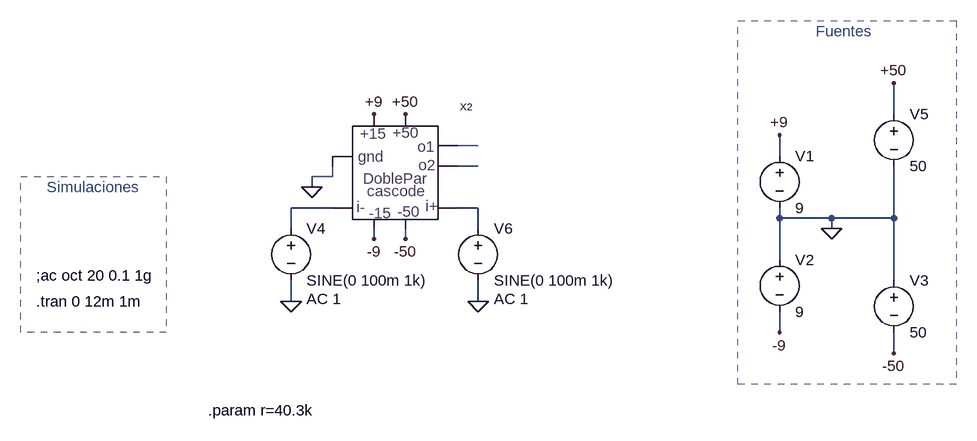
[diagram p0: schematic CMRR-doble-par.asc]
CMRR-doble-par.asc, the LTspice schematic file:
Version 4
SHEET 1 980 680
WIRE 880 32 880 -16
WIRE 240 80 208 80
WIRE 704 96 704 64
WIRE 240 112 208 112
WIRE 16 128 16 112
WIRE 16 128 -16 128
WIRE -16 144 -16 128
WIRE 16 176 -48 176
WIRE 240 176 208 176
WIRE 704 192 704 176
WIRE 784 192 704 192
WIRE 880 192 880 112
WIRE 880 192 784 192
WIRE -48 208 -48 176
WIRE 240 208 240 176
WIRE 784 208 784 192
WIRE 80 224 80 208
WIRE 128 224 128 208
WIRE 704 256 704 192
WIRE 880 288 880 192
WIRE -48 320 -48 288
WIRE 240 320 240 288
WIRE 704 368 704 336
WIRE 880 400 880 368
FLAG 784 208 0
FLAG 704 64 +9
FLAG 704 368 -9
FLAG 880 400 -50
FLAG 80 32 +9
FLAG 80 224 -9
FLAG 128 224 -50
FLAG 240 320 0
FLAG -48 320 0
FLAG 880 -16 +50
FLAG 128 32 +50
FLAG -16 144 0
SYMBOL rui\\shortcuts\\voltage 704 80 R0
WINDOW 123 0 0 Left 2
WINDOW 39 0 0 Left 2
SYMATTR InstName V1
SYMATTR Value 9
SYMBOL rui\\shortcuts\\voltage 704 240 R0
WINDOW 123 0 0 Left 2
WINDOW 39 0 0 Left 2
SYMATTR InstName V2
SYMATTR Value 9
SYMBOL rui\\shortcuts\\voltage 880 272 R0
WINDOW 123 0 0 Left 2
WINDOW 39 0 0 Left 2
SYMATTR InstName V3
SYMATTR Value 50
SYMBOL rui\\shortcuts\\voltage -48 192 R0
WINDOW 123 24 124 Left 2
WINDOW 39 0 0 Left 2
SYMATTR Value2 AC 1
SYMATTR InstName V4
SYMATTR Value SINE(0 100m 1k)
SYMBOL rui\\shortcuts\\voltage 880 16 R0
WINDOW 123 0 0 Left 2
WINDOW 39 0 0 Left 2
SYMATTR InstName V5
SYMATTR Value 50
SYMBOL ss-doble-par 112 112 R0
SYMATTR InstName X2
SYMATTR SpiceLine rcs=2k4
SYMBOL rui\\shortcuts\\voltage 240 192 R0
WINDOW 123 24 124 Left 2
WINDOW 39 0 0 Left 2
SYMATTR Value2 AC 1
SYMATTR InstName V6
SYMATTR Value SINE(0 100m 1k)
TEXT -440 320 Left 2 !.tran 0 12m 1m
TEXT -440 280 Left 2 !;ac oct 20 0.1 1g
TEXT -176 488 Left 2 !.param r=40.3k
TEXT -424 144 Left 2 ;Simulaciones
TEXT 760 -96 Left 2 ;Fuentes
RECTANGLE Normal -240 368 -464 128 2
RECTANGLE Normal 976 448 640 -112 2

The netlist it stands for:
* CMRR-doble-par.asc
V1 +9 0 9
V2 0 -9 9
V3 0 -50 50
V4 N003 0 SINE(0 100m 1k) AC 1
V5 +50 0 50
XX2 N003 N004 N001 +50 -50 0 N002 +9 -9 ss-doble-par rcs=2k4  ; pins i- i+ o1 +50 -50 grnd o2 +15 -15
V6 N004 0 SINE(0 100m 1k) AC 1
.tran 0 12m 1m
;ac oct 20 0.1 1g
.param r=40.3k
* Simulaciones
* Fuentes
.backanno
.end